# EasyEDA schematic 1-Schematic_CnE Project PCB.json
TITLE: Sheet_1; REV: 1.0; Date: 2025-05-19; Sheet: 1/1; Drawn By: rafaelmarvinjo; Company: Your Company
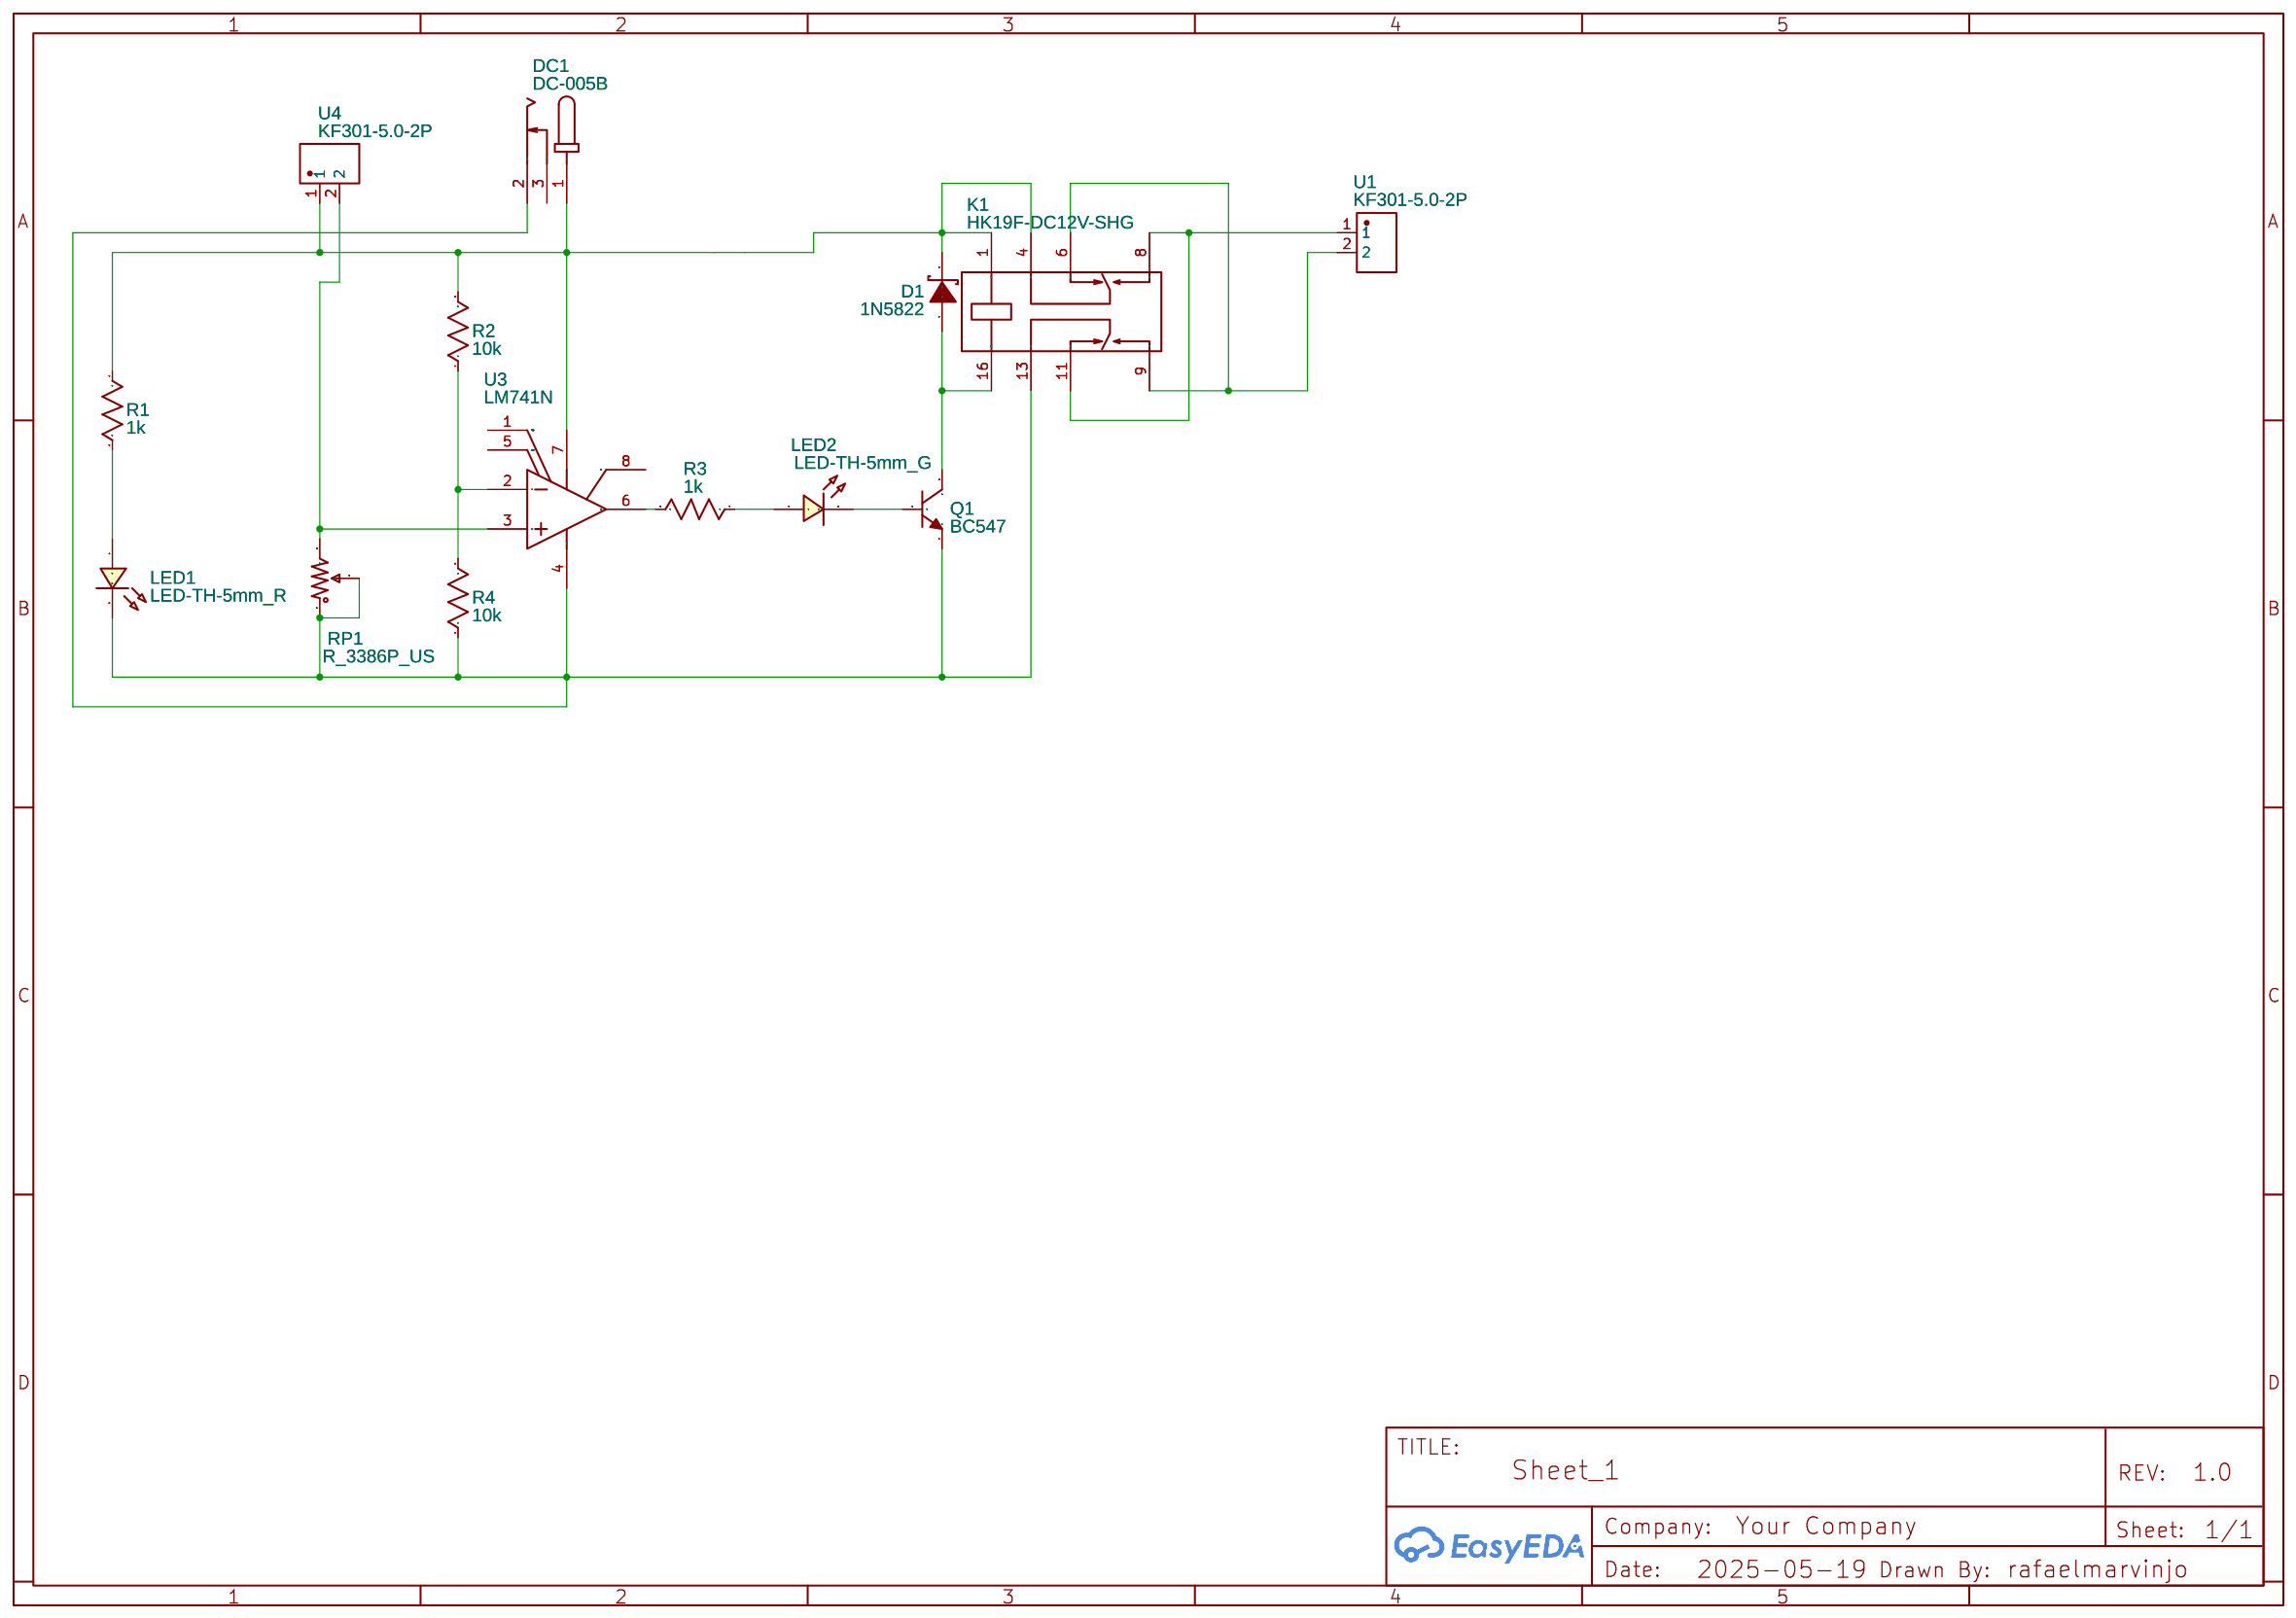
[diagram p0: schematic sheet]

## Parts
D1  1N5822  [DO-201AD_BD5.3-L8.4-P12.50-D1.4-FD]
DC1  DC-005B  [DC-IN-TH_DC-005B]
K1  HK19F-DC12V-SHG  [RELAY-TH_HK19F-XXXX-XXX]
LED1  LED-TH-5mm_R  [LED-TH_BD5.0_RED]
LED2  LED-TH-5mm_G  [LED-TH_BD5.0_GREEN]
Q1  BC547  [TO-92-3_L5.1-W4.1-P1.27-L]
R1  1k  [R_AXIAL-0.3]
R2  10k  [R_AXIAL-0.3]
R3  1k  [R_AXIAL-0.3]
R4  10k  [R_AXIAL-0.3]
RP1  R_3386P_US  [RES-ADJ-TH_3386P]
U1  KF301-5.0-2P  [CONN-TH_P5.00_KF301-5.0-2P]
U3  LM741N  [DIP-8_L9.3-W6.4-P2.54-LS7.6-BL]
U4  KF301-5.0-2P  [CONN-TH_P5.00_KF301-5.0-2P]

## Library data of the parts
D1 = 1N5822: Supplier: LCSC; Manufacturer: MDD(辰达半导体); Supplier Part: C2476; JLCPCB Part Class: Extended Part
DC1 = DC-005B: Contributor: lcsc; Supplier: LCSC; Supplier Part: C9900026788; Manufacturer: null
K1 = HK19F-DC12V-SHG: Supplier: LCSC; Manufacturer: 汇科; Supplier Part: C42803; JLCPCB Part Class: Extended Part
LED1 = LED-TH-5mm_R: Manufacturer: EVERLIGHT(台湾亿光); Manufacturer Part: 333-2SURD/S530-A3; Supplier Part: C87271; Supplier: LCSC; Contributor: LCEDA_Lib
LED2 = LED-TH-5mm_G: Manufacturer: EVERLIGHT(台湾亿光); Manufacturer Part: 333-2SYGD/S530-E2; Supplier Part: C88163; Supplier: LCSC; Contributor: LCEDA_Lib
Q1 = 2N3904(TO-92): Supplier: LCSC; Manufacturer: SEMTECH; Manufacturer Part: 2N3904; Supplier Part: C118538; Contributor: LCEDA_Lib
R1-R4 = R_AXIAL-0.3_US: Contributor: LCEDA_Lib
RP1 = R_3386P_US: Supplier: LCSC; Contributor: LCEDA_Lib; value(Ω): 10K
U1 U4 = KF301-5.0-2P: Contributor: LCSC; Supplier: LCSC; Supplier Part: C474881; Manufacturer: KEFA(科发); JLCPCB Part Class: Extended Part
U3 = LM741N: Supplier: LCSC; Supplier Part: C22446595; Manufacturer: HGSEMI(华冠); Contributor: lcsc; JLCPCB Part Class: Extended Part

## Nets
Net-(D1-1): D1.1(A) K1.16 Q1.3(C)
Net-(D1-2): D1.2(K) DC1.1 K1.1 K1.4 R1.1 R2.2 U3.7(V+) U4.1
Net-(DC1-2): DC1.2 K1.13 LED1.2 Q1.1(E) R4.1 RP1.1 RP1.2 U3.4(V-)
Net-(K1-6): K1.6 K1.9 U1.2
Net-(K1-8): K1.8 K1.11 U1.1
Net-(LED1-1): LED1.1 R1.2
Net-(LED2-1): LED2.1 R3.1
Net-(LED2-2): LED2.2 Q1.2(B)
Net-(R2-1): R2.1 R4.2 U3.2(-IN)
Net-(R3-2): R3.2 U3.6(OUT)
Net-(RP1-3): RP1.3 U3.3(+IN) U4.2

Not connected (* = marked no-connect by the designer): DC1 3; U3 1(OFFSET NULL) 5(OFFSET NULL) 8(NC)
